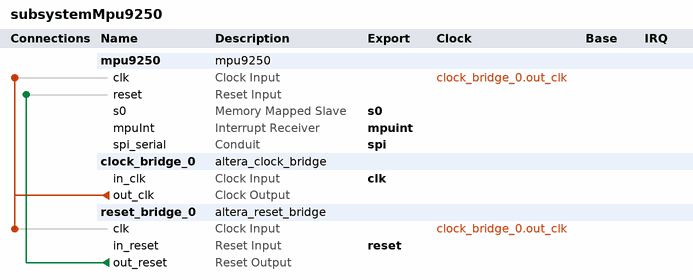
[diagram p0: system contents]
# Platform Designer (Qsys) system subsystemMpu9250, Cyclone V 5CSEMA5F31C6
# Parameters at their usual value, and those the tool derives, are not listed.
package require -exact qsys 18.1
create_system subsystemMpu9250
set_project_property DEVICE_FAMILY {Cyclone V}
set_project_property DEVICE 5CSEMA5F31C6

add_instance mpu9250 mpu9250 1.0
set_instance_parameter_value mpu9250 gClkFrequency 50000000

add_instance clock_bridge_0 altera_clock_bridge 18.1
set_instance_parameter_value clock_bridge_0 DERIVED_CLOCK_RATE 0
set_instance_parameter_value clock_bridge_0 EXPLICIT_CLOCK_RATE 0

add_instance reset_bridge_0 altera_reset_bridge 18.1
set_instance_parameter_value reset_bridge_0 ACTIVE_LOW_RESET 1
set_instance_parameter_value reset_bridge_0 SYNCHRONOUS_EDGES deassert

# connections
add_connection clock_bridge_0.out_clk mpu9250.clk clock
add_connection clock_bridge_0.out_clk reset_bridge_0.clk clock
add_connection reset_bridge_0.out_reset mpu9250.reset reset

# exported interfaces
add_interface clk clock sink
set_interface_property clk EXPORT_OF clock_bridge_0.in_clk
add_interface mpuint interrupt receiver
set_interface_property mpuint EXPORT_OF mpu9250.mpuInt
add_interface reset reset sink
set_interface_property reset EXPORT_OF reset_bridge_0.in_reset
add_interface s0 avalon slave
set_interface_property s0 EXPORT_OF mpu9250.s0
add_interface spi conduit end
set_interface_property spi EXPORT_OF mpu9250.spi_serial

set_interconnect_requirement {$system} qsys_mm.clockCrossingAdapter HANDSHAKE
set_interconnect_requirement {$system} qsys_mm.enableEccProtection FALSE
set_interconnect_requirement {$system} qsys_mm.insertDefaultSlave FALSE
set_interconnect_requirement {$system} qsys_mm.maxAdditionalLatency 1

save_system subsystemMpu9250.qsys
